# Altium schematic sheet 03.Keys.SchDoc
size A4
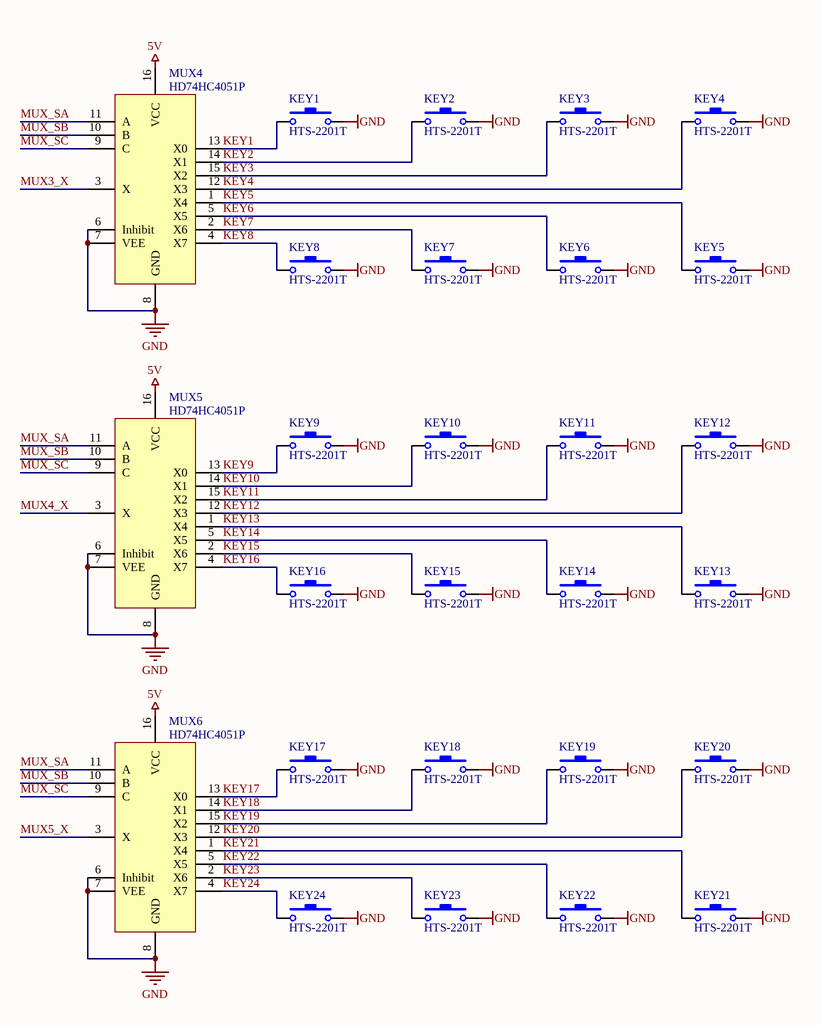
[diagram p0: 03.Keys.SchDoc]

## Parts
KEY1  HTS-2201T  [ALPS-SKHC-12mm - NO SILK]
KEY2  HTS-2201T  [ALPS-SKHC-12mm - NO SILK]
KEY3  HTS-2201T  [ALPS-SKHC-12mm - NO SILK]
KEY4  HTS-2201T  [ALPS-SKHC-12mm - NO SILK]
KEY5  HTS-2201T  [ALPS-SKHC-12mm - NO SILK]
KEY6  HTS-2201T  [ALPS-SKHC-12mm - NO SILK]
KEY7  HTS-2201T  [ALPS-SKHC-12mm - NO SILK]
KEY8  HTS-2201T  [ALPS-SKHC-12mm - NO SILK]
KEY9  HTS-2201T  [ALPS-SKHC-12mm - NO SILK]
KEY10  HTS-2201T  [ALPS-SKHC-12mm - NO SILK]
KEY11  HTS-2201T  [ALPS-SKHC-12mm - NO SILK]
KEY12  HTS-2201T  [ALPS-SKHC-12mm - NO SILK]
KEY13  HTS-2201T  [ALPS-SKHC-12mm - NO SILK]
KEY14  HTS-2201T  [ALPS-SKHC-12mm - NO SILK]
KEY15  HTS-2201T  [ALPS-SKHC-12mm - NO SILK]
KEY16  HTS-2201T  [ALPS-SKHC-12mm - NO SILK]
KEY17  HTS-2201T  [ALPS-SKHC-12mm - NO SILK]
KEY18  HTS-2201T  [ALPS-SKHC-12mm - NO SILK]
KEY19  HTS-2201T  [ALPS-SKHC-12mm - NO SILK]
KEY20  HTS-2201T  [ALPS-SKHC-12mm - NO SILK]
KEY21  HTS-2201T  [ALPS-SKHC-12mm - NO SILK]
KEY22  HTS-2201T  [ALPS-SKHC-12mm - NO SILK]
KEY23  HTS-2201T  [ALPS-SKHC-12mm - NO SILK]
KEY24  HTS-2201T  [ALPS-SKHC-12mm - NO SILK]
MUX4  HD74HC4051P  [DIP-16]
MUX5  HD74HC4051P  [DIP-16]
MUX6  HD74HC4051P  [DIP-16]

## Nets
5V: MUX4.16(VCC) MUX5.16(VCC) MUX6.16(VCC)
GND: KEY1.1 KEY2.1 KEY3.1 KEY4.1 KEY5.1 KEY6.1 KEY7.1 KEY8.1 KEY9.1 KEY10.1 KEY11.1 KEY12.1 KEY13.1 KEY14.1 KEY15.1 KEY16.1 KEY17.1 KEY18.1 KEY19.1 KEY20.1 KEY21.1 KEY22.1 KEY23.1 KEY24.1 MUX4.6(Inhibit) MUX4.7(VEE) MUX4.8(GND) MUX5.6(Inhibit) MUX5.7(VEE) MUX5.8(GND) MUX6.6(Inhibit) MUX6.7(VEE) MUX6.8(GND)
KEY1: KEY1.2 MUX4.13(X0)
KEY2: KEY2.2 MUX4.14(X1)
KEY3: KEY3.2 MUX4.15(X2)
KEY4: KEY4.2 MUX4.12(X3)
KEY5: KEY5.2 MUX4.1(X4)
KEY6: KEY6.2 MUX4.5(X5)
KEY7: KEY7.2 MUX4.2(X6)
KEY8: KEY8.2 MUX4.4(X7)
KEY9: KEY9.2 MUX5.13(X0)
KEY10: KEY10.2 MUX5.14(X1)
KEY11: KEY11.2 MUX5.15(X2)
KEY12: KEY12.2 MUX5.12(X3)
KEY13: KEY13.2 MUX5.1(X4)
KEY14: KEY14.2 MUX5.5(X5)
KEY15: KEY15.2 MUX5.2(X6)
KEY16: KEY16.2 MUX5.4(X7)
KEY17: KEY17.2 MUX6.13(X0)
KEY18: KEY18.2 MUX6.14(X1)
KEY19: KEY19.2 MUX6.15(X2)
KEY20: KEY20.2 MUX6.12(X3)
KEY21: KEY21.2 MUX6.1(X4)
KEY22: KEY22.2 MUX6.5(X5)
KEY23: KEY23.2 MUX6.2(X6)
KEY24: KEY24.2 MUX6.4(X7)
MUX3_X: MUX4.3(X)
MUX4_X: MUX5.3(X)
MUX5_X: MUX6.3(X)
MUX_SA: MUX4.11(A) MUX5.11(A) MUX6.11(A)
MUX_SB: MUX4.10(B) MUX5.10(B) MUX6.10(B)
MUX_SC: MUX4.9(C) MUX5.9(C) MUX6.9(C)

## Library data of the parts
KEY1-KEY24 = Tact Switch HTS-2201T
MUX4-MUX6 = TC74HC4051AF